# Altium project Cube_Brain.PrjPcb
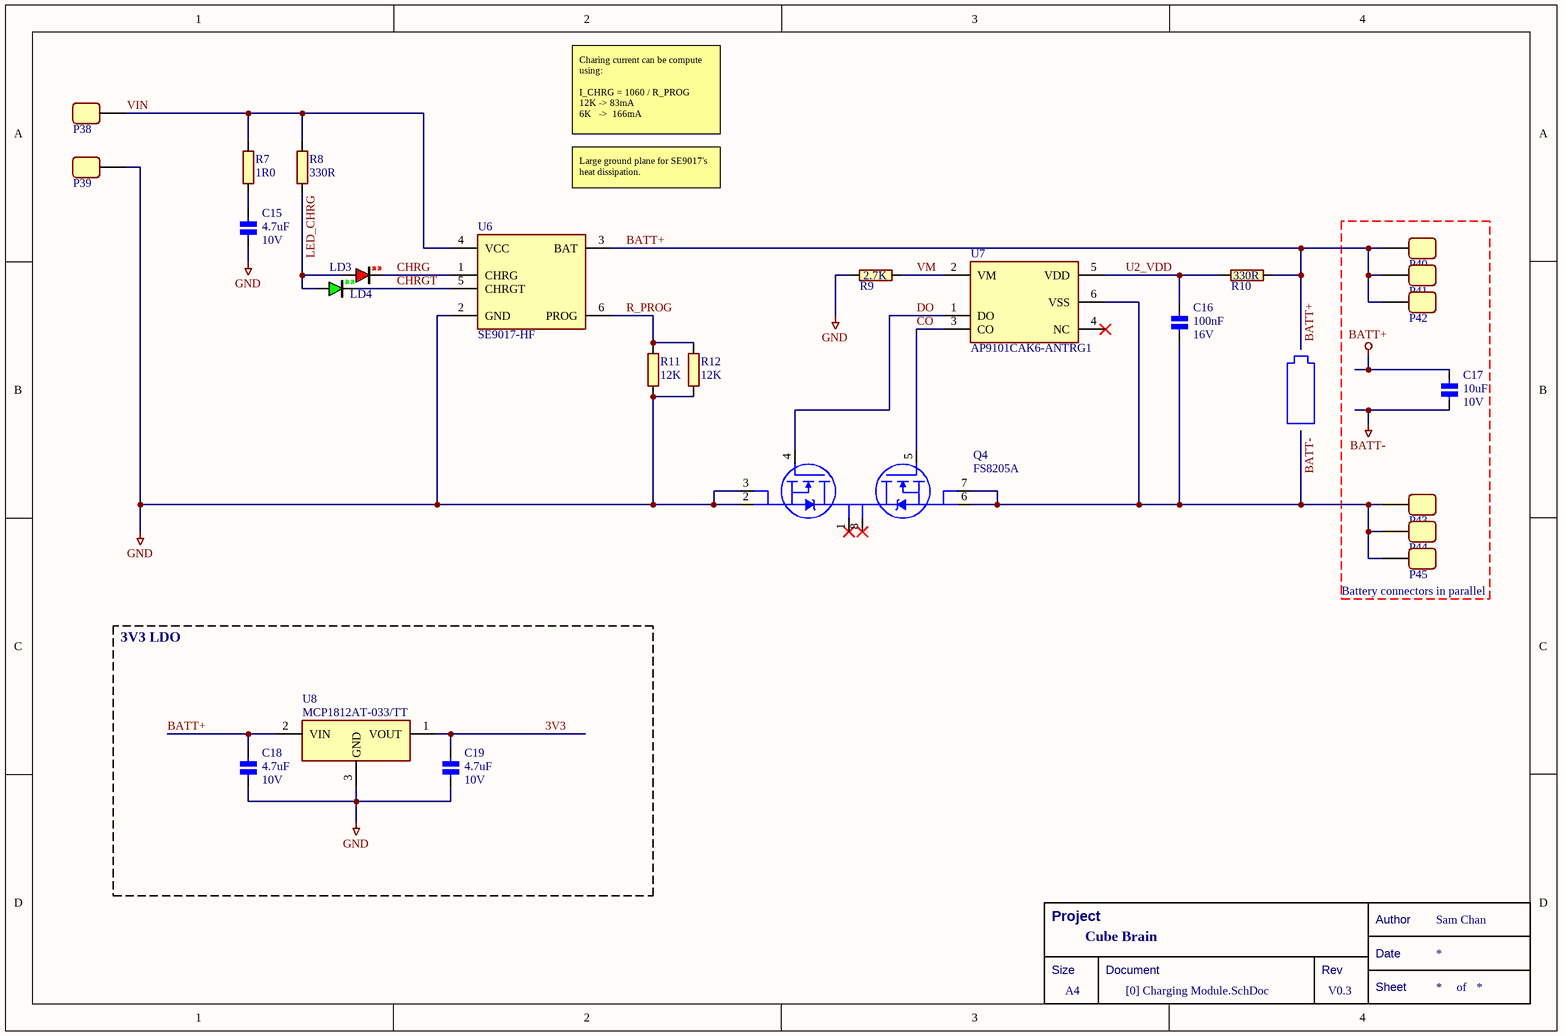
[diagram p0: [0] Charging Module.SchDoc]
Project: Cube Brain; VersionRevision: V0.3
5 sheets, 97 parts. Net scope: global (net labels, ports and power ports of the same name join across sheets).
Board file: Cube_Brain_PCB.PcbDoc
Sheets:
  [0] Charging Module.SchDoc
  [1] MCU and BLE.SchDoc
  [2] IMU.SchDoc
  [3] Motor Drives.SchDoc
  [4] Sensor Boards.SchDoc

## Sheet [0] Charging Module.SchDoc
size A4

### Parts
(Parts that share a designator on the sheet are numbered #1, #2 ... from top to bottom, then left to right.)
*#1  Title Block  (value not drawn)  (graphical)
C15  Voltage - Rated: 10V  [CAPC0402X05N]  (hidden comment: 4.7uF)
C16  Voltage - Rated: 16V  [CAPC0402X05N]  (hidden comment: 100nF)
C17  Voltage - Rated: 10V  [CAPC0402X05N]  (hidden comment: 10uF)
C18  Voltage - Rated: 10V  [CAPC0402X05N]  (hidden comment: 4.7uF)
C19  Voltage - Rated: 10V  [CAPC0402X05N]  (hidden comment: 4.7uF)
LD3  Red  [LEDM0603X08N_RED]  (value not drawn)
LD4  Green  [LEDM0603X08N_GREEN]  (value not drawn)
P38  PAD_4  [PAD_0.5X1MM]  (value not drawn)  (no BOM)
P39  PAD_4  [PAD_0.5X1MM]  (value not drawn)  (no BOM)
P40  PAD_4  [PAD_0.5X1MM]  (value not drawn)  (no BOM)
P41  PAD_4  [PAD_0.5X1MM]  (value not drawn)  (no BOM)
P42  PAD_4  [PAD_0.5X1MM]  (value not drawn)  (no BOM)
P43  PAD_4  [PAD_0.5X1MM]  (value not drawn)  (no BOM)
P44  PAD_4  [PAD_0.5X1MM]  (value not drawn)  (no BOM)
P45  PAD_4  [PAD_0.5X1MM]  (value not drawn)  (no BOM)
Q4  FS8205A  [FS8205A]
R7  1R0  [RESC0402X04N]
R8  330R  [RESC0402X04N]
R9  2.7K  [RESC0402X04N]
R10  330R  [RESC0402X04N]
R11  12K  [RESC0402X04N]
R12  12K  [RESC0402X04N]
U6  SE9017-HF  [SE9017-HF]
U7  AP9101CAK6-ANTRG1  [AP9101CAK6]
U8  MCP1812AT-033/TT  [MCP1812AT-033/TT]

### Blocks framed on the sheet
Battery connectors in parallel: C17 P40-P45
3V3 LDO: C18 C19 U8

### Nets
3V3: C19.1 U8.1(VOUT)
BATT+: C17.1 C18.1 P40.1 P41.1 P42.1 R10.2 U6.3(BAT) U8.2(VIN)
BATT-: C16.2 C17.2 P43.1 P44.1 P45.1 Q4.6(S2) Q4.7(S2) U7.6(VSS)
GND: C15.2 C18.2 C19.2 P39.1 Q4.2(S1) Q4.3(S1) R9.1 R11.2 R12.2 U6.2(GND) U8.3(GND)
CHRG: LD3.2 U6.1(CHRG)
CHRGT: LD4.2 U6.5(CHRGT)
CO: Q4.5(G2) U7.3(CO)
DO: Q4.4(G1) U7.1(DO)
LED_CHRG: LD3.1 LD4.1 R8.1
R_PROG: R11.1 R12.1 U6.6(PROG)
U2_VDD: C16.1 R10.1 U7.5(VDD)
VIN: P38.1 R7.2 R8.2 U6.4(VCC)
VM: R9.2 U7.2(VM)
NetC15_1: C15.1 R7.1

Not connected (* = marked no-connect by the designer): Q4 1(D12)* 8(D12)*; U7 4(NC)*

### Notes on the sheet
- Charing current can be compute using:
  I_CHRG = 1060 / R_PROG
  12K -> 83mA
  6K   ->  166mA
- Large ground plane for SE9017's heat dissipation.
- (in symbol Title Block) Project; Author; Sam Chan; Date; Size; Document; Rev; A4; Sheet; of

### Library data of the parts
*#1 = Title Block: Standard Title Block
C15 C18 C19 = CER 4.7UF 10V: CAP CER 4.7UF 10V X5R 0402; Manufacturer: Samsung Electro-Mechanics; Manufacturer Part Number: CL05A475MP5NRNC; Category: Capacitors; Supplier 1: LCSC; Supplier Part Number 1: C23733; Package / Case: 0402; Capacitance: 4.7uF
C16 = CER 100NF 16V: CAP CER 0.1UF 16V X7R 0402; Manufacturer: Samsung Electro-Mechanics; Manufacturer Part Number: CL05B104KO5NNNC; Category: Capacitors; Supplier 1: LCSC; Supplier Part Number 1: C1525; Package / Case: 0402; Capacitance: 100nF
C17 = CER 10UF 10V: CAP CER 10UF 10V X5R 0402; Manufacturer: Murata Electronics; Manufacturer Part Number: GRM155R61A106ME44D; Category: Capacitors; Supplier 1: LCSC; Supplier Part Number 1: C77000; Package / Case: 0402; Capacitance: 10uF
LD3 = LED 0603 RED: LED RED CLEAR CHIP SMD; Manufacturer: Lite-On Inc.; Manufacturer Part Number: LTST-C190KRKT; Category: LED; Package / Case: 0603 (1608 Metric); Color: Red; Supplier 1: LCSC; Supplier Part Number 1: C94869
LD4 = LED 0603 GREEN: LED GREEN CLEAR CHIP SMD; Manufacturer: Lite-On Inc.; Manufacturer Part Number: LTST-C190KGKT; Category: LED; Package / Case: 0603 (1608 Metric); Color: Green; Supplier 1: LCSC; Supplier Part Number 1: C125094
P38-P45 = PAD_4: a Rec pad, 0.5X1mm
Q4 = FS8205A: MOSFET 2N-CH 20V 6A TSSOP8; Manufacturer: Fortune Semicon; Category: Transistors; Case: TSSOP-8; Manufacturer Part Number: FS8205A; Supplier 1: LCSC; Supplier Part Number 1: C16052
R7 = RES 1R: RES SMD 11RK OHM 1% 1/16W 0402; Manufacturer: YAGEO; Manufacturer Part Number: RC0402FR-071RL; Category: Resistors; Package / Case: 0402; Supplier 1: LCSC; Supplier Part Number 1: C185446; Resistance: 1R0
R8 R10 = RES 330R: RES SMD 330R OHM 1% 1/16W 0402; Manufacturer: YAGEO; Manufacturer Part Number: RC0402FR-07330RL; Category: Resistors; Package / Case: 0402; Supplier 1: LCSC; Supplier Part Number 1: C105875; Resistance: 330R
R9 = RES 2.7K: RES SMD 2.7K OHM 1% 1/16W 0402; Manufacturer: YAGEO; Manufacturer Part Number: AC0402FR-072K7L; Category: Resistors; Package / Case: 0402; Supplier 1: LCSC; Supplier Part Number 1: C144771; Resistance: 2.7K
R11 R12 = RES 12K: RES SMD 12K OHM 1% 1/16W 0402; Manufacturer: YAGEO; Manufacturer Part Number: RC0402FR-0712KL; Category: Resistors; Package / Case: 0402; Supplier 1: LCSC; Supplier Part Number 1: C114760; Resistance: 12K
U6 = SE9017-HF: IC LI-ION/LI-POLY CTRLR SOT23-6; Manufacturer: Seaward Elec; Category: PMIC - Battery Chargers; Case: SOT-23-6; Manufacturer Part Number: SE9017-HF; Supplier 1: LCSC; Supplier Part Number 1: C115751
U7 = AP9101CAK6-ANTRG1: IC BATT PROT LI-ION 1-CELL SOT26; Manufacturer: Diodes Incorporated; Category: PMIC - Battery Management; Case: SOT-23-6; Manufacturer Part Number: AP9101CAK6-ANTRG1; Supplier 1: Digi-Key; Supplier Part Number 1: AP9101CAK6-ANTRG1DICT-ND
U8 = MCP1812AT-033/TT: IC REG LINEAR 3.3V 300MA SOT23-3; Manufacturer: Microchip Technology; Categories: Voltage Regulators - Linear; Case: TO-236-3, SC-59, SOT-23-3; Manufacturer Part Number: MCP1812AT-033/TT; Supplier 1: Digi-Key; Supplier Part Number 1: MCP1812AT-033/TTCT-ND

## Sheet [1] MCU and BLE.SchDoc
size A4
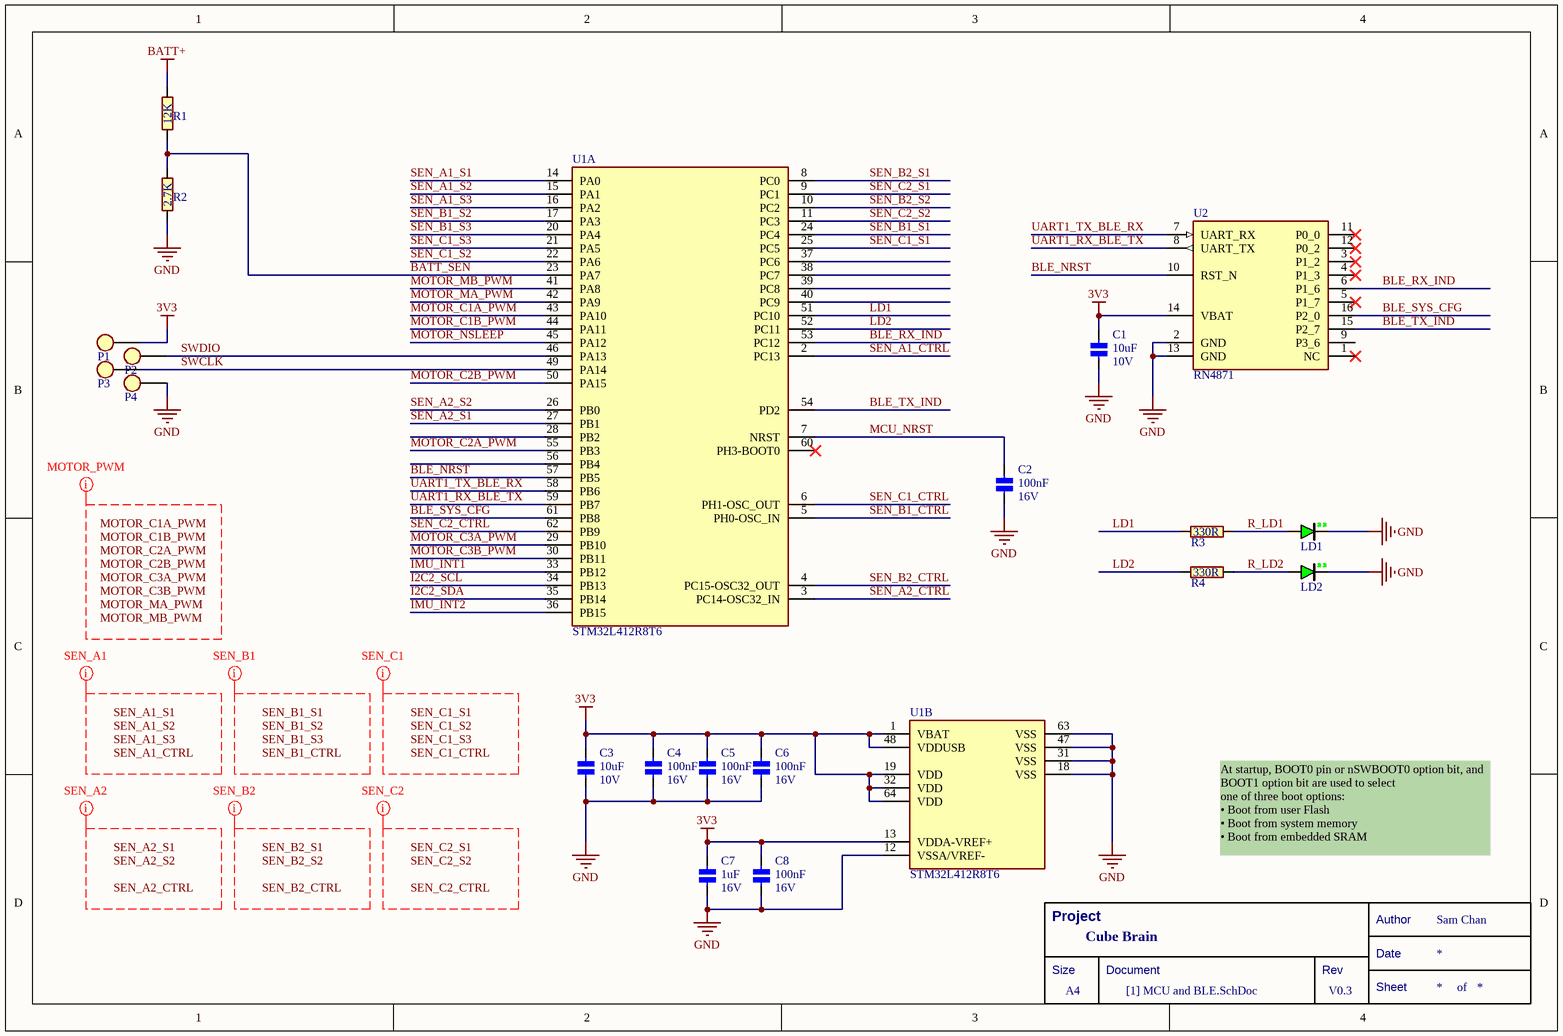
[diagram p1: [1] MCU and BLE.SchDoc]

### Parts
(Parts that share a designator on the sheet are numbered #1, #2 ... from top to bottom, then left to right.)
*#2  Title Block  (value not drawn)  (graphical)
C1  Voltage - Rated: 10V  [CAPC0402X05N]  (hidden comment: 10uF)
C2  Voltage - Rated: 16V  [CAPC0402X05N]  (hidden comment: 100nF)
C3  Voltage - Rated: 10V  [CAPC0402X05N]  (hidden comment: 10uF)
C4  Voltage - Rated: 16V  [CAPC0402X05N]  (hidden comment: 100nF)
C5  Voltage - Rated: 16V  [CAPC0402X05N]  (hidden comment: 100nF)
C6  Voltage - Rated: 16V  [CAPC0402X05N]  (hidden comment: 100nF)
C7  Voltage - Rated: 16V  [CAPC0402X05N]  (hidden comment: 1uF)
C8  Voltage - Rated: 16V  [CAPC0402X05N]  (hidden comment: 100nF)
LD1  Green  [LEDM0603X08N_GREEN]  (value not drawn)
LD2  Green  [LEDM0603X08N_GREEN]  (value not drawn)
P1  PAD_3  [PAD_ROUND_1MM]  (value not drawn)  (no BOM)
P2  PAD_3  [PAD_ROUND_1MM]  (value not drawn)  (no BOM)
P3  PAD_3  [PAD_ROUND_1MM]  (value not drawn)  (no BOM)
P4  PAD_3  [PAD_ROUND_1MM]  (value not drawn)  (no BOM)
R1  12K  [RESC0402X04N]
R2  2.7K  [RESC0402X04N]
R3  330R  [RESC0402X04N]
R4  330R  [RESC0402X04N]
U1  STM32L412R8T6  [STM32L412R]  (parts A,B of 2)
U2  RN4871  [RN4871]

### Nets
3V3: C1.1 C3.1 C4.1 C5.1 C6.1 C7.1 C8.1 P1.1 U1.1(VBAT) U1.13(VDDA-VREF+) U1.19(VDD) U1.32(VDD) U1.48(VDDUSB) U1.64(VDD) U2.14(VBAT)
BATT+: R1.2
GND: C1.2 C2.2 C3.2 C4.2 C5.2 C6.2 C7.2 C8.2 LD1.2 LD2.2 P4.1 R2.1 U1.12(VSSA/VREF-) U1.18(VSS) U1.31(VSS) U1.47(VSS) U1.63(VSS) U2.2(GND) U2.13(GND)
BATT_SEN: R1.1 R2.2 U1.23(PA7)
BLE_NRST: U1.57(PB5) U2.10(RST_N)
BLE_RX_IND: U1.53(PC12) U2.6(P1_6)
BLE_SYS_CFG: U1.61(PB8) U2.16(P2_0)
BLE_TX_IND: U1.54(PD2) U2.15(P2_7)
I2C2_SCL: U1.34(PB13)
I2C2_SDA: U1.35(PB14)
IMU_INT1: U1.33(PB12)
IMU_INT2: U1.36(PB15)
LD1: R3.1 U1.51(PC10)
LD2: R4.1 U1.52(PC11)
MCU_NRST: C2.1 U1.7(NRST)
MOTOR_C1A_PWM: U1.43(PA10)
MOTOR_C1B_PWM: U1.44(PA11)
MOTOR_C2A_PWM: U1.55(PB3)
MOTOR_C2B_PWM: U1.50(PA15)
MOTOR_C3A_PWM: U1.29(PB10)
MOTOR_C3B_PWM: U1.30(PB11)
MOTOR_MA_PWM: U1.42(PA9)
MOTOR_MB_PWM: U1.41(PA8)
MOTOR_NSLEEP: U1.45(PA12)
R_LD1: LD1.1 R3.2
R_LD2: LD2.1 R4.2
SEN_A1_CTRL: U1.2(PC13)
SEN_A1_S1: U1.14(PA0)
SEN_A1_S2: U1.15(PA1)
SEN_A1_S3: U1.16(PA2)
SEN_A2_CTRL: U1.3(PC14-OSC32_IN)
SEN_A2_S1: U1.27(PB1)
SEN_A2_S2: U1.26(PB0)
SEN_B1_CTRL: U1.5(PH0-OSC_IN)
SEN_B1_S1: U1.24(PC4)
SEN_B1_S2: U1.17(PA3)
SEN_B1_S3: U1.20(PA4)
SEN_B2_CTRL: U1.4(PC15-OSC32_OUT)
SEN_B2_S1: U1.8(PC0)
SEN_B2_S2: U1.10(PC2)
SEN_C1_CTRL: U1.6(PH1-OSC_OUT)
SEN_C1_S1: U1.25(PC5)
SEN_C1_S2: U1.22(PA6)
SEN_C1_S3: U1.21(PA5)
SEN_C2_CTRL: U1.62(PB9)
SEN_C2_S1: U1.9(PC1)
SEN_C2_S2: U1.11(PC3)
SWCLK: P3.1 U1.49(PA14)
SWDIO: P2.1 U1.46(PA13)
UART1_RX_BLE_TX: U1.59(PB7) U2.8(UART_TX)
UART1_TX_BLE_RX: U1.58(PB6) U2.7(UART_RX)

Not connected (* = marked no-connect by the designer): U1 28(PB2) 37(PC6) 38(PC7) 39(PC8) 40(PC9) 56(PB4) 60(PH3-BOOT0)*; U2 1(NC)* 3(P1_2)* 4(P1_3)* 5(P1_7)* 9(P3_6) 11(P0_0)* 12(P0_2)*

### Layout directives
net class MOTOR_PWM: MOTOR_C1A_PWM, MOTOR_C1B_PWM, MOTOR_C2A_PWM, MOTOR_C2B_PWM, MOTOR_C3A_PWM, MOTOR_C3B_PWM, MOTOR_MA_PWM, MOTOR_MB_PWM
net class SEN_A1: SEN_A1_CTRL, SEN_A1_S1, SEN_A1_S2, SEN_A1_S3
net class SEN_A2: SEN_A2_CTRL, SEN_A2_S1, SEN_A2_S2
net class SEN_B1: SEN_B1_CTRL, SEN_B1_S1, SEN_B1_S2, SEN_B1_S3
net class SEN_B2: SEN_B2_CTRL, SEN_B2_S1, SEN_B2_S2
net class SEN_C1: SEN_C1_CTRL, SEN_C1_S1, SEN_C1_S2, SEN_C1_S3
net class SEN_C2: SEN_C2_CTRL, SEN_C2_S1, SEN_C2_S2

### Notes on the sheet
- At startup, BOOT0 pin or nSWBOOT0 option bit, and BOOT1 option bit are used to select
  one of three boot options:
  • Boot from user Flash
  • Boot from system memory
  • Boot from embedded SRAM
- Labels drawn without touching a wire or pin: MOTOR_C1A_PWM, MOTOR_C1B_PWM, MOTOR_C2A_PWM, MOTOR_C2B_PWM, MOTOR_C3A_PWM, MOTOR_C3B_PWM, MOTOR_MA_PWM, MOTOR_MB_PWM, SEN_A1_CTRL, SEN_A1_S1, SEN_A1_S2, SEN_A1_S3, SEN_A2_CTRL, SEN_A2_S1, SEN_A2_S2, SEN_B1_CTRL, SEN_B1_S1, SEN_B1_S2, SEN_B1_S3, SEN_B2_CTRL, SEN_B2_S1, SEN_B2_S2, SEN_C1_CTRL, SEN_C1_S1, SEN_C1_S2, SEN_C1_S3, SEN_C2_CTRL, SEN_C2_S1, SEN_C2_S2
- (in symbol Title Block) Project; Author; Sam Chan; Date; Size; Document; Rev; A4; Sheet; of

### Library data of the parts
*#2 = Title Block: Standard Title Block
C1 C3 = CER 10UF 10V: as C17 on sheet [0] Charging Module; Category: Capacitors; Supplier 1: LCSC; Supplier Part Number 1: C77000; Package / Case: 0402; Capacitance: 10uF
C2 C4-C6 C8 = CER 100NF 16V: as C16 on sheet [0] Charging Module; Category: Capacitors; Supplier 1: LCSC; Supplier Part Number 1: C1525; Package / Case: 0402; Capacitance: 100nF
C7 = CER 1UF 16V: CAP CER 1UF 16V X5R 0402; Manufacturer: Samsung Electro-Mechanics; Manufacturer Part Number: CL05A105KO5NNNC; Category: Capacitors; Supplier 1: LCSC; Supplier Part Number 1: C29266; Package / Case: 0402; Capacitance: 1uF
LD1 LD2 = LED 0603 GREEN: as LD4 on sheet [0] Charging Module; Category: LED; Package / Case: 0603 (1608 Metric); Color: Green; Supplier 1: LCSC; Supplier Part Number 1: C125094
P1-P4 = PAD_3: a Round Pad 1mm
R1 = RES 12K: as R11 on sheet [0] Charging Module; Category: Resistors; Package / Case: 0402; Supplier 1: LCSC; Supplier Part Number 1: C114760; Resistance: 12K
R2 = RES 2.7K: as R9 on sheet [0] Charging Module; Category: Resistors; Package / Case: 0402; Supplier 1: LCSC; Supplier Part Number 1: C144771; Resistance: 2.7K
R3 R4 = RES 330R: as R8 on sheet [0] Charging Module; Category: Resistors; Package / Case: 0402; Supplier 1: LCSC; Supplier Part Number 1: C105875; Resistance: 330R
U1 = STM32L412R8T6: ARM® Cortex®-M4 STM32L4 Microcontroller IC 32-Bit 80MHz 64KB (64K x 8) FLASH 64-LQFP (10x10); Manufacturer: STMicroelectronics; Categories: Microcontrollers; Manufacturer Part Number: STM32L412R8T6; Case: 64-LQFP (10x10); Notes: -
U2 = RN4871: Bluetooth Bluetooth v5.0 Transceiver Module 2.4GHz Integrated, Chip Surface Mount; Manufacturer: Microchip Technology; Manufacturer Part Number: RN4871-I/RM130; Categories: RF Transceiver Modules; Case: 16-SMD Module

## Sheet [2] IMU.SchDoc
size A4
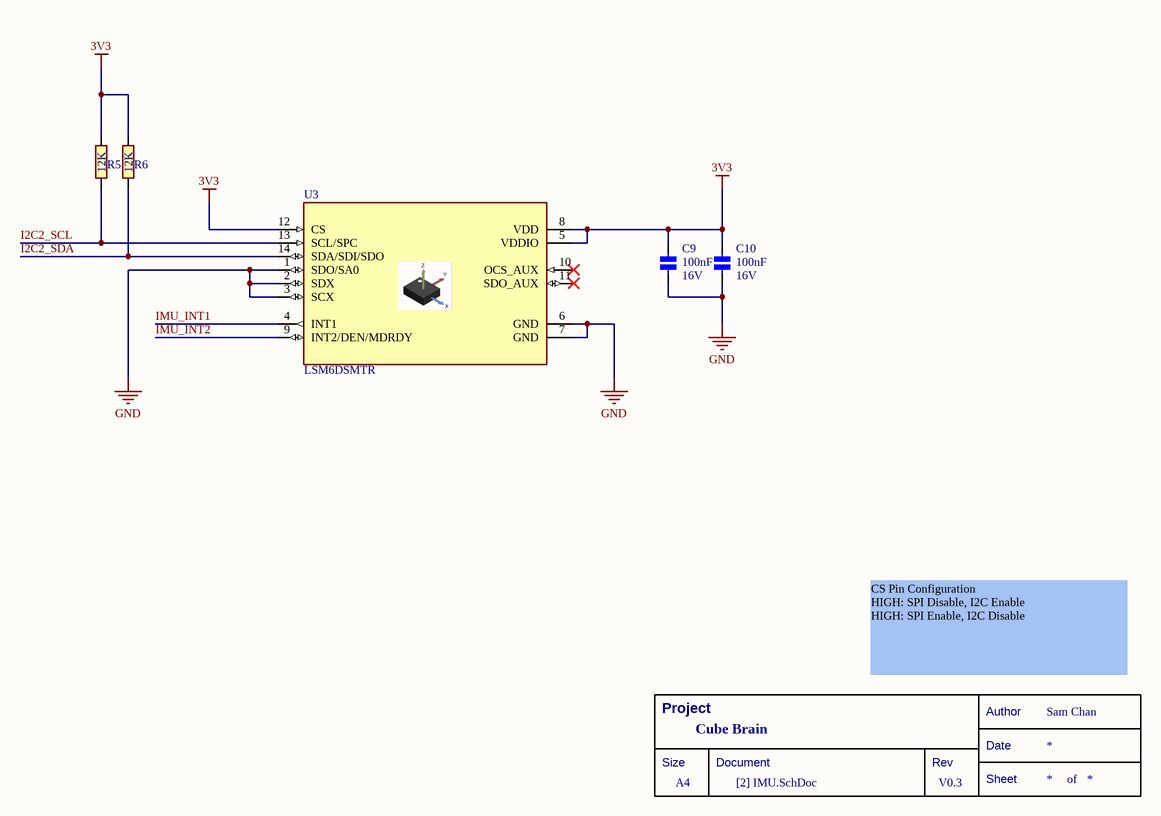
[diagram p2: [2] IMU.SchDoc]

### Parts
(Parts that share a designator on the sheet are numbered #1, #2 ... from top to bottom, then left to right.)
*#3  Title Block  (value not drawn)  (graphical)
C9  Voltage - Rated: 16V  [CAPC0402X05N]  (hidden comment: 100nF)
C10  Voltage - Rated: 16V  [CAPC0402X05N]  (hidden comment: 100nF)
R5  12K  [RESC0402X04N]
R6  12K  [RESC0402X04N]
U3  LSM6DSMTR  [LSM6DSMTR]

### Nets
3V3: C9.1 C10.1 R5.2 R6.2 U3.5(VDDIO) U3.8(VDD) U3.12(CS)
GND: C9.2 C10.2 U3.1(SDO/SA0) U3.2(SDX) U3.3(SCX) U3.6(GND) U3.7(GND)
I2C2_SCL: R5.1 U3.13(SCL/SPC)
I2C2_SDA: R6.1 U3.14(SDA/SDI/SDO)
IMU_INT1: U3.4(INT1)
IMU_INT2: U3.9(INT2/DEN/MDRDY)

Not connected (* = marked no-connect by the designer): U3 10(OCS_AUX)* 11(SDO_AUX)*

### Notes on the sheet
- CS Pin Configuration
  HIGH: SPI Disable, I2C Enable
  HIGH: SPI Enable, I2C Disable
- (in symbol Title Block) Project; Author; Sam Chan; Date; Size; Document; Rev; A4; Sheet; of

### Library data of the parts
*#3 = Title Block: Standard Title Block
C9 C10 = CER 100NF 16V: as C16 on sheet [0] Charging Module; Category: Capacitors; Supplier 1: LCSC; Supplier Part Number 1: C1525; Package / Case: 0402; Capacitance: 100nF
R5 R6 = RES 12K: as R11 on sheet [0] Charging Module; Category: Resistors; Package / Case: 0402; Supplier 1: LCSC; Supplier Part Number 1: C114760; Resistance: 12K
U3 = LSM6DSMTR: IMU ACCEL/GYRO I2C/SPI 14LGA; Manufacturer: STMicroelectronics; Categories: IMUs (Inertial Measurement Units); Case: 14-VFLGA Module; Manufacturer Part Number: LSM6DSMTR; Supplier 1: Digi-Key; Supplier Part Number 1: 497-16696-1-ND

## Sheet [3] Motor Drives.SchDoc
size A4
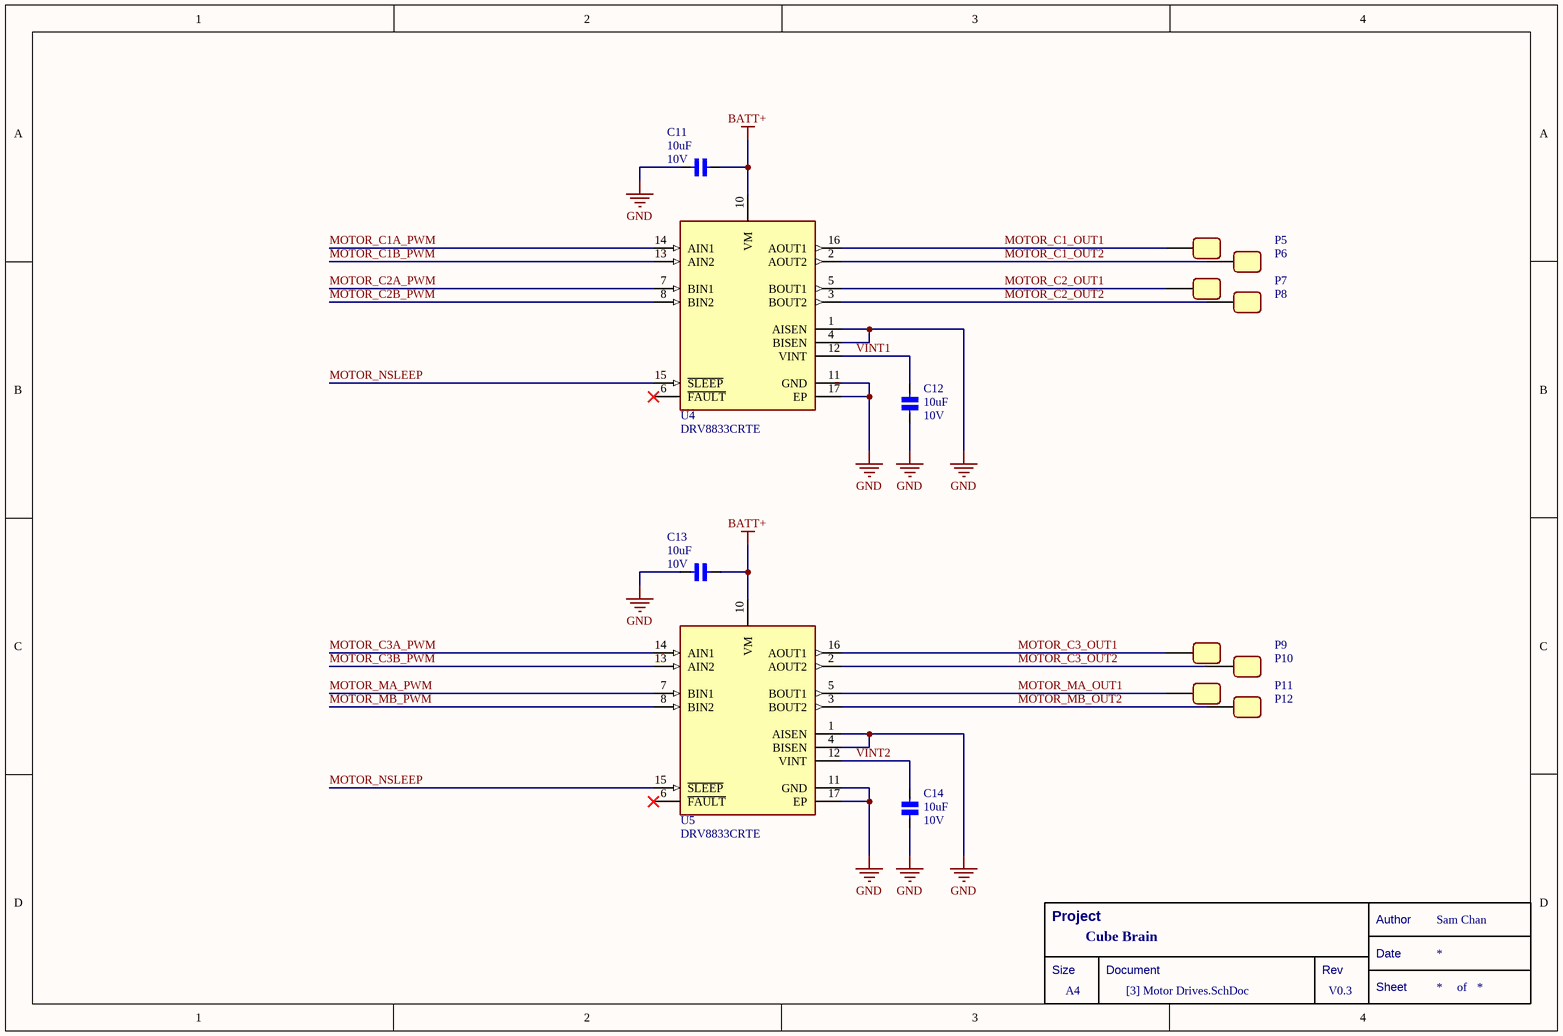
[diagram p3: [3] Motor Drives.SchDoc]

### Parts
(Parts that share a designator on the sheet are numbered #1, #2 ... from top to bottom, then left to right.)
*#4  Title Block  (value not drawn)  (graphical)
C11  Voltage - Rated: 10V  [CAPC0402X05N]  (hidden comment: 10uF)
C12  Voltage - Rated: 10V  [CAPC0402X05N]  (hidden comment: 10uF)
C13  Voltage - Rated: 10V  [CAPC0402X05N]  (hidden comment: 10uF)
C14  Voltage - Rated: 10V  [CAPC0402X05N]  (hidden comment: 10uF)
P5  PAD_1  [PAD_1.0X1.5MM]  (value not drawn)  (no BOM)
P6  PAD_1  [PAD_1.0X1.5MM]  (value not drawn)  (no BOM)
P7  PAD_1  [PAD_1.0X1.5MM]  (value not drawn)  (no BOM)
P8  PAD_1  [PAD_1.0X1.5MM]  (value not drawn)  (no BOM)
P9  PAD_1  [PAD_1.0X1.5MM]  (value not drawn)  (no BOM)
P10  PAD_1  [PAD_1.0X1.5MM]  (value not drawn)  (no BOM)
P11  PAD_1  [PAD_1.0X1.5MM]  (value not drawn)  (no BOM)
P12  PAD_1  [PAD_1.0X1.5MM]  (value not drawn)  (no BOM)
U4  DRV8833CRTE  [DRV8833CRTER]
U5  DRV8833CRTE  [DRV8833CRTER]

### Nets
BATT+: C11.2 C13.2 U4.10(VM) U5.10(VM)
GND: C11.1 C12.2 C13.1 C14.2 U4.1(AISEN) U4.4(BISEN) U4.11(GND) U4.17(EP) U5.1(AISEN) U5.4(BISEN) U5.11(GND) U5.17(EP)
MOTOR_C1_OUT1: P5.1 U4.16(AOUT1)
MOTOR_C1_OUT2: P6.1 U4.2(AOUT2)
MOTOR_C1A_PWM: U4.14(AIN1)
MOTOR_C1B_PWM: U4.13(AIN2)
MOTOR_C2_OUT1: P7.1 U4.5(BOUT1)
MOTOR_C2_OUT2: P8.1 U4.3(BOUT2)
MOTOR_C2A_PWM: U4.7(BIN1)
MOTOR_C2B_PWM: U4.8(BIN2)
MOTOR_C3_OUT1: P9.1 U5.16(AOUT1)
MOTOR_C3_OUT2: P10.1 U5.2(AOUT2)
MOTOR_C3A_PWM: U5.14(AIN1)
MOTOR_C3B_PWM: U5.13(AIN2)
MOTOR_MA_OUT1: P11.1 U5.5(BOUT1)
MOTOR_MA_PWM: U5.7(BIN1)
MOTOR_MB_OUT2: P12.1 U5.3(BOUT2)
MOTOR_MB_PWM: U5.8(BIN2)
MOTOR_NSLEEP: U4.15(~{SLEEP}) U5.15(~{SLEEP})
VINT1: C12.1 U4.12(VINT)
VINT2: C14.1 U5.12(VINT)

Not connected (* = marked no-connect by the designer): U4 6(~{FAULT})*; U5 6(~{FAULT})*

### Notes on the sheet
- (in symbol Title Block) Project; Author; Sam Chan; Date; Size; Document; Rev; A4; Sheet; of

### Library data of the parts
*#4 = Title Block: Standard Title Block
C11-C14 = CER 10UF 10V: as C17 on sheet [0] Charging Module; Category: Capacitors; Supplier 1: LCSC; Supplier Part Number 1: C77000; Package / Case: 0402; Capacitance: 10uF
P5-P12 = PAD_1: a Rec Pad, 1.0X1.5mm
U4 U5 = DRV8833CRTE: Bipolar Motor Driver Power MOSFET PWM 16-WQFN (3x3); Manufacturer: Texas Instruments; Categories: Motor Drivers, Controllers; Case: 16-WQFN Exposed Pad; Manufacturer Part Number: DRV8833CRTE; Supplier 1: LCSC; Supplier Part Number 1: C154936

## Sheet [4] Sensor Boards.SchDoc
size A4
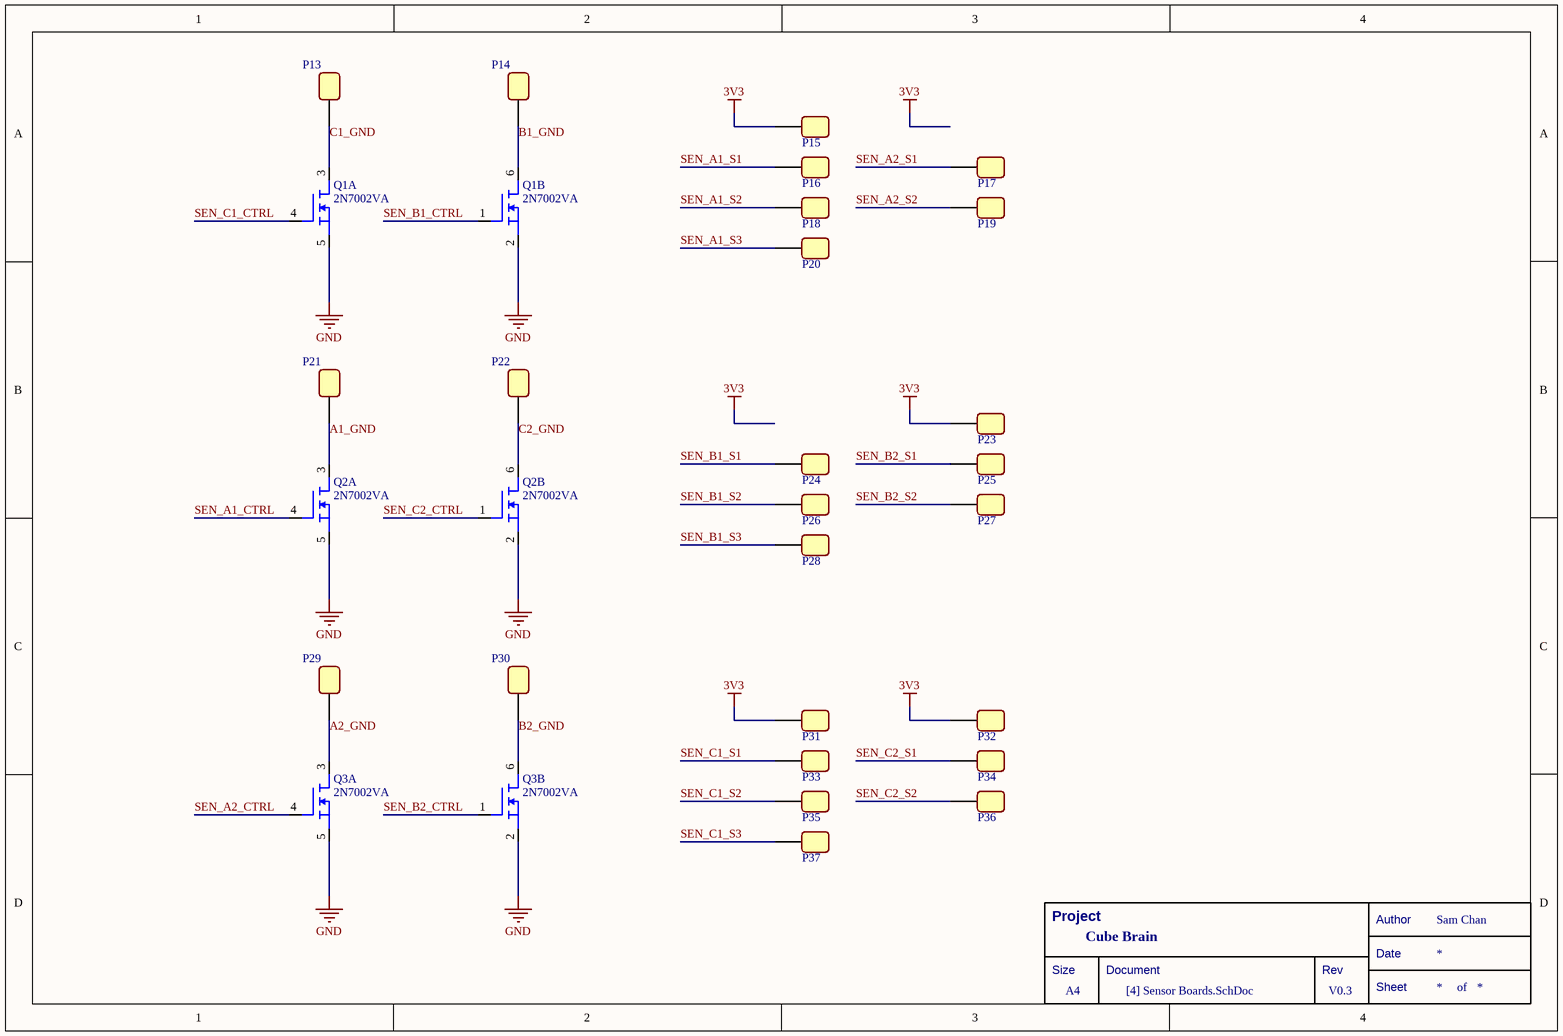
[diagram p4: [4] Sensor Boards.SchDoc]

### Parts
(Parts that share a designator on the sheet are numbered #1, #2 ... from top to bottom, then left to right.)
*#5  Title Block  (value not drawn)  (graphical)
P13  PAD_4  [PAD_0.5X1MM]  (value not drawn)  (no BOM)
P14  PAD_4  [PAD_0.5X1MM]  (value not drawn)  (no BOM)
P15  PAD_4  [PAD_0.5X1MM]  (value not drawn)  (no BOM)
P16  PAD_4  [PAD_0.5X1MM]  (value not drawn)  (no BOM)
P17  PAD_4  [PAD_0.5X1MM]  (value not drawn)  (no BOM)
P18  PAD_4  [PAD_0.5X1MM]  (value not drawn)  (no BOM)
P19  PAD_4  [PAD_0.5X1MM]  (value not drawn)  (no BOM)
P20  PAD_4  [PAD_0.5X1MM]  (value not drawn)  (no BOM)
P21  PAD_4  [PAD_0.5X1MM]  (value not drawn)  (no BOM)
P22  PAD_4  [PAD_0.5X1MM]  (value not drawn)  (no BOM)
P23  PAD_4  [PAD_0.5X1MM]  (value not drawn)  (no BOM)
P24  PAD_4  [PAD_0.5X1MM]  (value not drawn)  (no BOM)
P25  PAD_4  [PAD_0.5X1MM]  (value not drawn)  (no BOM)
P26  PAD_4  [PAD_0.5X1MM]  (value not drawn)  (no BOM)
P27  PAD_4  [PAD_0.5X1MM]  (value not drawn)  (no BOM)
P28  PAD_4  [PAD_0.5X1MM]  (value not drawn)  (no BOM)
P29  PAD_4  [PAD_0.5X1MM]  (value not drawn)  (no BOM)
P30  PAD_4  [PAD_0.5X1MM]  (value not drawn)  (no BOM)
P31  PAD_4  [PAD_0.5X1MM]  (value not drawn)  (no BOM)
P32  PAD_4  [PAD_0.5X1MM]  (value not drawn)  (no BOM)
P33  PAD_4  [PAD_0.5X1MM]  (value not drawn)  (no BOM)
P34  PAD_4  [PAD_0.5X1MM]  (value not drawn)  (no BOM)
P35  PAD_4  [PAD_0.5X1MM]  (value not drawn)  (no BOM)
P36  PAD_4  [PAD_0.5X1MM]  (value not drawn)  (no BOM)
P37  PAD_4  [PAD_0.5X1MM]  (value not drawn)  (no BOM)
Q1  2N7002VA  [2N7002VA]  (parts A,B of 2)
Q2  2N7002VA  [2N7002VA]  (parts A,B of 2)
Q3  2N7002VA  [2N7002VA]  (parts A,B of 2)

### Nets
3V3: P15.1 P23.1 P31.1 P32.1
GND: Q1.2(S2) Q1.5(S1) Q2.2(S2) Q2.5(S1) Q3.2(S2) Q3.5(S1)
A1_GND: P21.1 Q2.3(D1)
A2_GND: P29.1 Q3.3(D1)
B1_GND: P14.1 Q1.6(D2)
B2_GND: P30.1 Q3.6(D2)
C1_GND: P13.1 Q1.3(D1)
C2_GND: P22.1 Q2.6(D2)
SEN_A1_CTRL: Q2.4(G1)
SEN_A1_S1: P16.1
SEN_A1_S2: P18.1
SEN_A1_S3: P20.1
SEN_A2_CTRL: Q3.4(G1)
SEN_A2_S1: P17.1
SEN_A2_S2: P19.1
SEN_B1_CTRL: Q1.1(G2)
SEN_B1_S1: P24.1
SEN_B1_S2: P26.1
SEN_B1_S3: P28.1
SEN_B2_CTRL: Q3.1(G2)
SEN_B2_S1: P25.1
SEN_B2_S2: P27.1
SEN_C1_CTRL: Q1.4(G1)
SEN_C1_S1: P33.1
SEN_C1_S2: P35.1
SEN_C1_S3: P37.1
SEN_C2_CTRL: Q2.1(G2)
SEN_C2_S1: P34.1
SEN_C2_S2: P36.1

### Notes on the sheet
- (in symbol Title Block) Project; Author; Sam Chan; Date; Size; Document; Rev; A4; Sheet; of

### Library data of the parts
*#5 = Title Block: Standard Title Block
P13-P37 = PAD_4: a Rec pad, 0.5X1mm
Q1-Q3 = 2N7002VA: Mosfet Array 2 N-Channel (Dual) 60V 280mA 150mW Surface Mount SOT-563; Manufacturer: Diodes Incorporated; Manufacturer Part Number: 2N7002VA-7-F; Categories: Transistors; Case: SOT-563; Notes: -

## Nets that join several sheets
3V3: [0] Charging Module (C19.1 U8.1), [1] MCU and BLE (15 pins), [2] IMU (7 pins), [4] Sensor Boards (P15.1 P23.1 P31.1 P32.1)
BATT+: [0] Charging Module (8 pins), [1] MCU and BLE (R1.2), [3] Motor Drives (C11.2 C13.2 U4.10 U5.10)
GND: [0] Charging Module (11 pins), [1] MCU and BLE (19 pins), [2] IMU (7 pins), [3] Motor Drives (12 pins), [4] Sensor Boards (6 pins)
I2C2_SCL: [1] MCU and BLE (U1.34), [2] IMU (R5.1 U3.13)
I2C2_SDA: [1] MCU and BLE (U1.35), [2] IMU (R6.1 U3.14)
IMU_INT1: [1] MCU and BLE (U1.33), [2] IMU (U3.4)
IMU_INT2: [1] MCU and BLE (U1.36), [2] IMU (U3.9)
MOTOR_C1A_PWM: [1] MCU and BLE (U1.43), [3] Motor Drives (U4.14)
MOTOR_C1B_PWM: [1] MCU and BLE (U1.44), [3] Motor Drives (U4.13)
MOTOR_C2A_PWM: [1] MCU and BLE (U1.55), [3] Motor Drives (U4.7)
MOTOR_C2B_PWM: [1] MCU and BLE (U1.50), [3] Motor Drives (U4.8)
MOTOR_C3A_PWM: [1] MCU and BLE (U1.29), [3] Motor Drives (U5.14)
MOTOR_C3B_PWM: [1] MCU and BLE (U1.30), [3] Motor Drives (U5.13)
MOTOR_MA_PWM: [1] MCU and BLE (U1.42), [3] Motor Drives (U5.7)
MOTOR_MB_PWM: [1] MCU and BLE (U1.41), [3] Motor Drives (U5.8)
MOTOR_NSLEEP: [1] MCU and BLE (U1.45), [3] Motor Drives (U4.15 U5.15)
SEN_A1_CTRL: [1] MCU and BLE (U1.2), [4] Sensor Boards (Q2.4)
SEN_A1_S1: [1] MCU and BLE (U1.14), [4] Sensor Boards (P16.1)
SEN_A1_S2: [1] MCU and BLE (U1.15), [4] Sensor Boards (P18.1)
SEN_A1_S3: [1] MCU and BLE (U1.16), [4] Sensor Boards (P20.1)
SEN_A2_CTRL: [1] MCU and BLE (U1.3), [4] Sensor Boards (Q3.4)
SEN_A2_S1: [1] MCU and BLE (U1.27), [4] Sensor Boards (P17.1)
SEN_A2_S2: [1] MCU and BLE (U1.26), [4] Sensor Boards (P19.1)
SEN_B1_CTRL: [1] MCU and BLE (U1.5), [4] Sensor Boards (Q1.1)
SEN_B1_S1: [1] MCU and BLE (U1.24), [4] Sensor Boards (P24.1)
SEN_B1_S2: [1] MCU and BLE (U1.17), [4] Sensor Boards (P26.1)
SEN_B1_S3: [1] MCU and BLE (U1.20), [4] Sensor Boards (P28.1)
SEN_B2_CTRL: [1] MCU and BLE (U1.4), [4] Sensor Boards (Q3.1)
SEN_B2_S1: [1] MCU and BLE (U1.8), [4] Sensor Boards (P25.1)
SEN_B2_S2: [1] MCU and BLE (U1.10), [4] Sensor Boards (P27.1)
SEN_C1_CTRL: [1] MCU and BLE (U1.6), [4] Sensor Boards (Q1.4)
SEN_C1_S1: [1] MCU and BLE (U1.25), [4] Sensor Boards (P33.1)
SEN_C1_S2: [1] MCU and BLE (U1.22), [4] Sensor Boards (P35.1)
SEN_C1_S3: [1] MCU and BLE (U1.21), [4] Sensor Boards (P37.1)
SEN_C2_CTRL: [1] MCU and BLE (U1.62), [4] Sensor Boards (Q2.1)
SEN_C2_S1: [1] MCU and BLE (U1.9), [4] Sensor Boards (P34.1)
SEN_C2_S2: [1] MCU and BLE (U1.11), [4] Sensor Boards (P36.1)